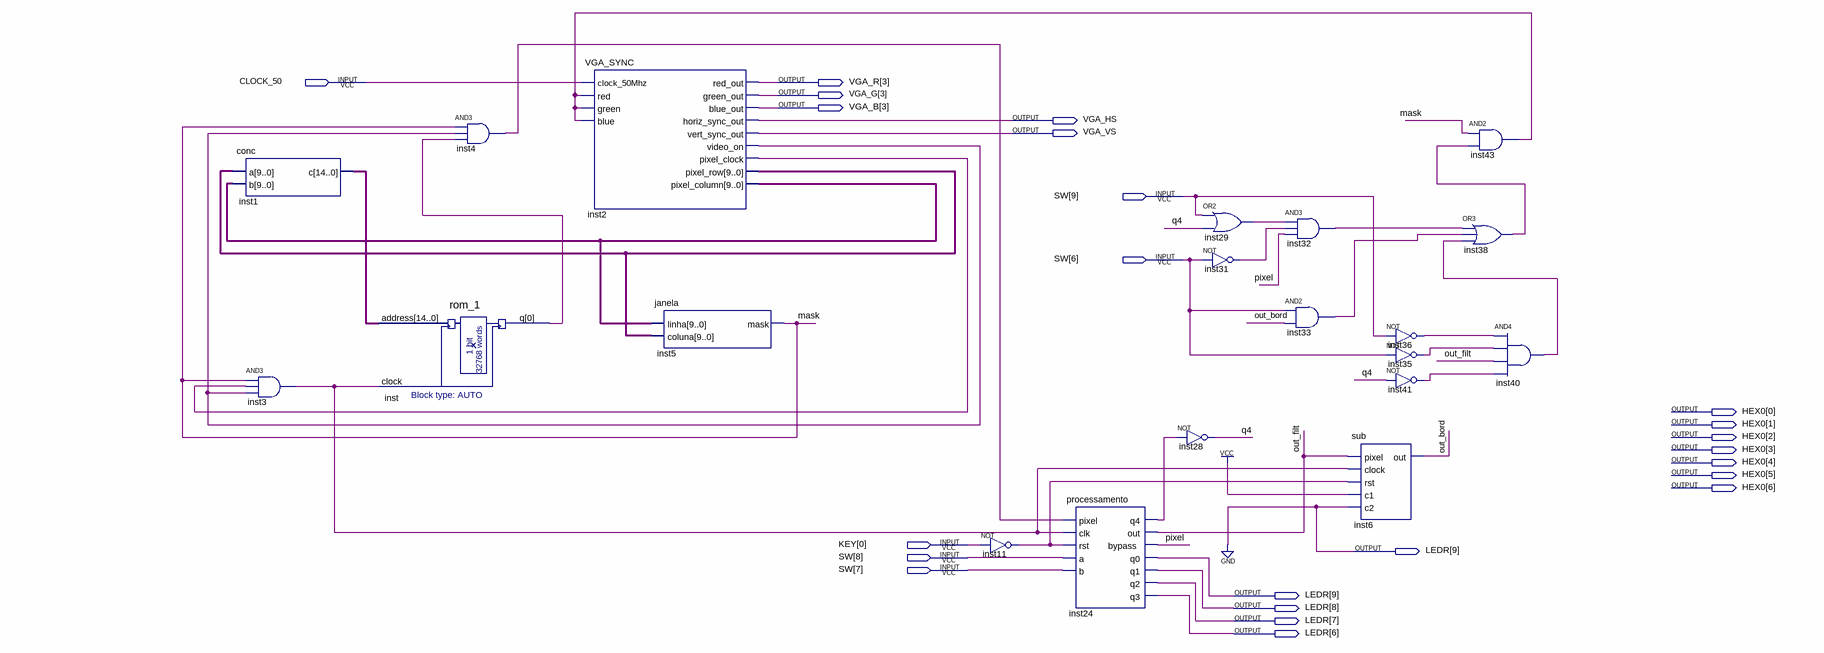
[diagram p0: schematic sheet]
// Quartus schematic proj1.bdf as structural Verilog: 20 symbols, 23 pins
module proj1 (
  input  CLOCK_50,
  input  [9:6] SW,
  input  [0:0] KEY,
  output [3:3] VGA_R,
  output [3:3] VGA_G,
  output [3:3] VGA_B,
  output VGA_HS,
  output VGA_VS,
  output [6:0] HEX0,
  output [9:6] LEDR
);

  wire inst2_pixel_clock, inst3_out, inst4_out, inst11_out, inst24_q4, inst29_out, inst31_out, inst32_out,
       inst33_out, inst35_out, inst36_out, inst38_out, inst40_out, inst41_out, inst43_out, inst_q, mask, on,
       out_bord, out_filt, pixel, q4;
  wire [9:0] inst2_pixel_column, inst2_pixel_row;
  wire [14:0] inst1_c;

  conc inst1 (.a(inst2_pixel_row), .b(inst2_pixel_column), .c(inst1_c));
  and inst3 (inst3_out, mask, inst2_pixel_clock, on);
  rom_1 inst (.address(inst1_c), .clock(inst3_out), .q(inst_q));
  and inst4 (inst4_out, mask, on, inst_q);
  VGA_SYNC inst2 (
    .clock_50Mhz(CLOCK_50), .red(inst43_out), .green(inst43_out), .blue(inst43_out), .red_out(VGA_R[3]),
    .green_out(VGA_G[3]), .blue_out(VGA_B[3]), .horiz_sync_out(VGA_HS), .vert_sync_out(VGA_VS),
    .video_on(on), .pixel_clock(inst2_pixel_clock), .pixel_row(inst2_pixel_row),
    .pixel_column(inst2_pixel_column));
  janela inst5 (.linha(inst2_pixel_column), .coluna(inst2_pixel_row), .mask(mask));
  not inst11 (inst11_out, KEY[0]);
  processamento inst24 (
    .pixel(inst4_out), .clk(inst3_out), .rst(inst11_out), .a(SW[8]), .b(SW[7]), .q4(inst24_q4),
    .out(out_filt), .bypass(pixel), .q0(LEDR[9]), .q1(LEDR[8]), .q2(LEDR[7]), .q3(LEDR[6]));
  not inst28 (q4, inst24_q4);
  or inst29 (inst29_out, SW[9], q4);
  not inst31 (inst31_out, SW[6]);
  and inst32 (inst32_out, inst29_out, inst31_out, pixel);
  and inst33 (inst33_out, SW[6], out_bord);
  sub inst6 (.pixel(out_filt), .clock(inst3_out), .rst(inst11_out), .c1(1'b1), .c2(LEDR[9]), .out(out_bord));
  not inst36 (inst36_out, SW[9]);
  not inst35 (inst35_out, SW[6]);
  not inst41 (inst41_out, q4);
  and inst43 (inst43_out, mask, inst38_out);
  or inst38 (inst38_out, inst32_out, inst33_out, inst40_out);
  and inst40 (inst40_out, inst36_out, inst35_out, out_filt, inst41_out);
  // also tied to GND on the sheet: LEDR[9]
endmodule
